# EAGLE design control-module (EAGLE 5.06)
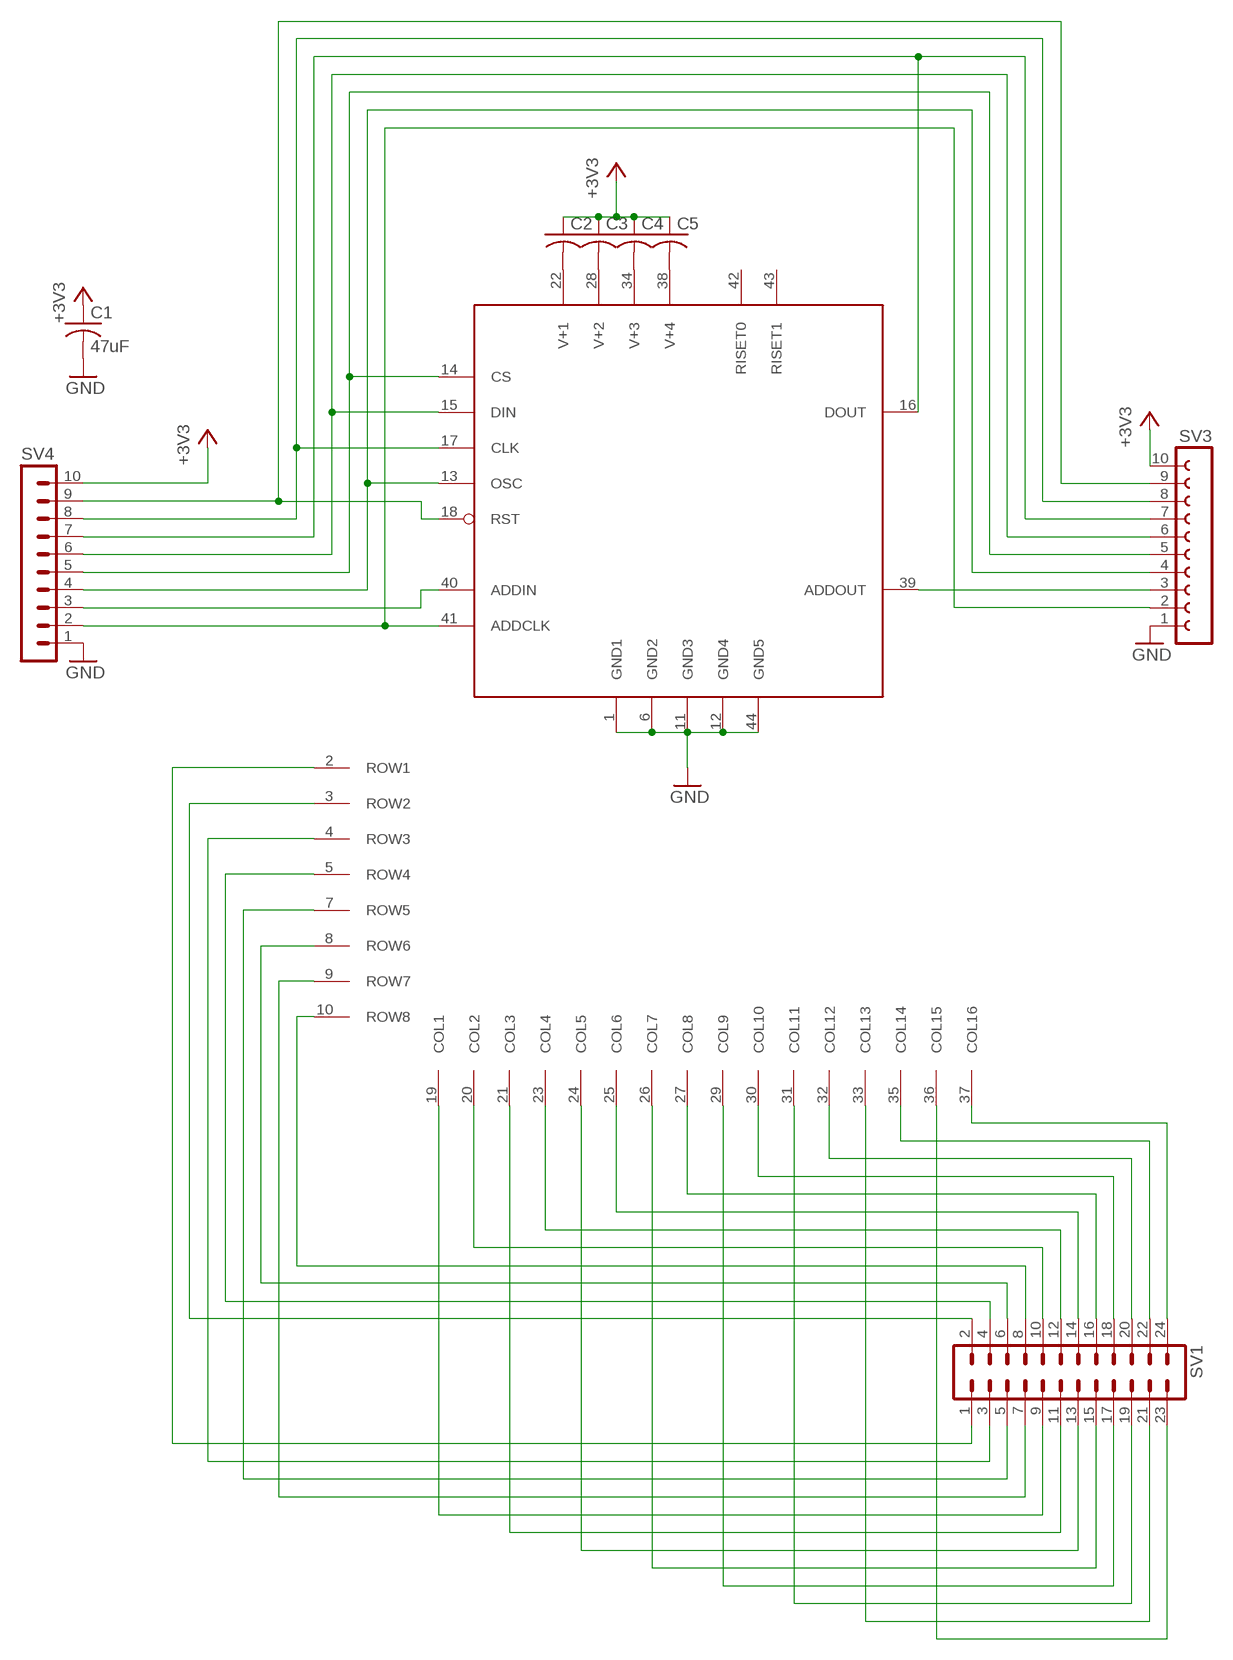
[diagram p0: schematic, sheet 1]

## Parts
C1  47uF  C-US025-024X044  [C025-024X044]
C2  C-USC2012  [C2012]
C3  C-USC2012  [C2012]
C4  C-USC2012  [C2012]
C5  C-USC2012  [C2012]
SV1  MA12-2  [MA12-2]
SV3  FE10-1  [FE10]
SV4  MA10-1  [MA10-1]
U$1  MAX6960_MQFP44  [MQFP44-2]

## Nets
+3V3: C1.1 C2.1 C3.1 C4.1 C5.1 SV3.10 SV4.10
GND: C1.2 SV3.1 SV4.1 U$1.1(GND1) U$1.6(GND2) U$1.11(GND3) U$1.12(GND4) U$1.44(GND5)
N$1: C2.2 U$1.22(V+1)
N$2: SV1.1 U$1.2(ROW1)
N$3: SV3.2 SV4.2 U$1.41(ADDCLK)
N$4: SV3.6 SV4.6 U$1.15(DIN)
N$5: SV3.9 SV4.9 U$1.18(RST)
N$6: SV3.3 U$1.39(ADDOUT)
N$7: SV1.2 U$1.3(ROW2)
N$8: SV1.3 U$1.4(ROW3)
N$9: SV3.8 SV4.8 U$1.17(CLK)
N$10: SV1.4 U$1.5(ROW4)
N$11: SV3.5 SV4.5 U$1.14(CS)
N$12: SV3.7 SV4.7 U$1.16(DOUT)
N$13: SV1.5 U$1.7(ROW5)
N$14: SV1.6 U$1.8(ROW6)
N$15: SV1.7 U$1.9(ROW7)
N$16: SV1.8 U$1.10(ROW8)
N$17: SV1.9 U$1.19(COL1)
N$18: SV1.11 U$1.21(COL3)
N$19: SV1.13 U$1.24(COL5)
N$20: SV1.15 U$1.26(COL7)
N$21: SV1.17 U$1.29(COL9)
N$22: SV1.19 U$1.31(COL11)
N$23: SV1.21 U$1.33(COL13)
N$24: SV1.23 U$1.36(COL15)
N$25: SV1.10 U$1.20(COL2)
N$26: SV1.12 U$1.23(COL4)
N$27: SV1.14 U$1.25(COL6)
N$28: SV1.16 U$1.27(COL8)
N$29: SV1.18 U$1.30(COL10)
N$30: SV1.20 U$1.32(COL12)
N$31: SV1.22 U$1.35(COL14)
N$32: SV1.24 U$1.37(COL16)
N$33: SV3.4 SV4.4 U$1.13(OSC)
N$34: C3.2 U$1.28(V+2)
N$35: SV4.3 U$1.40(ADDIN)
N$36: C4.2 U$1.34(V+3)
N$37: C5.2 U$1.38(V+4)
Unconnected: U$1.42(RISET0) U$1.43(RISET1)

## Library data of the parts
C1-C5 = resistor:C-US: CAPACITOR, American symbol
SV1 = con-lstb:MA12-2: PIN HEADER
SV3 = con-lsta:FE10-1: FEMALE HEADER
SV4 = con-lstb:MA10-1: PIN HEADER
U$1 = max6960:MAX6960_MQFP44

## Board
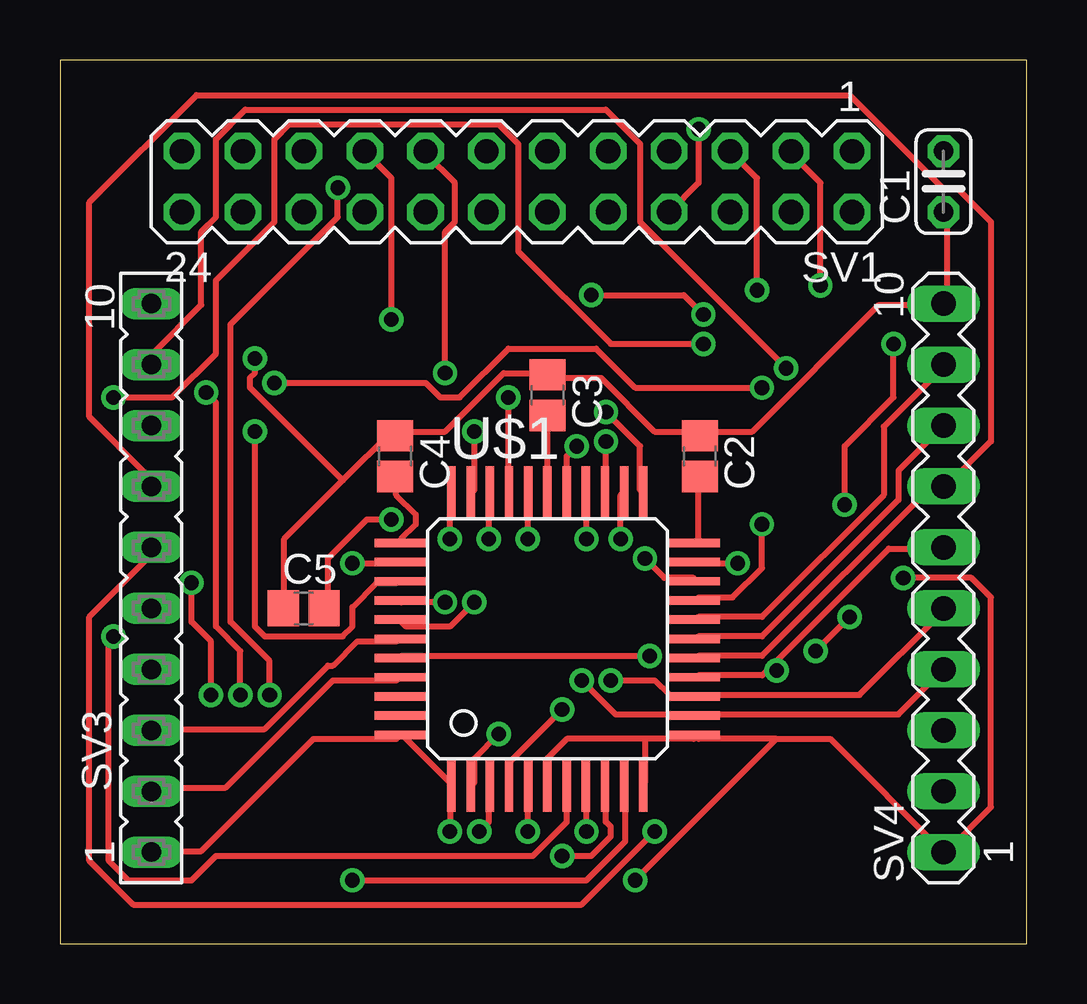
[diagram p1: board, top side]
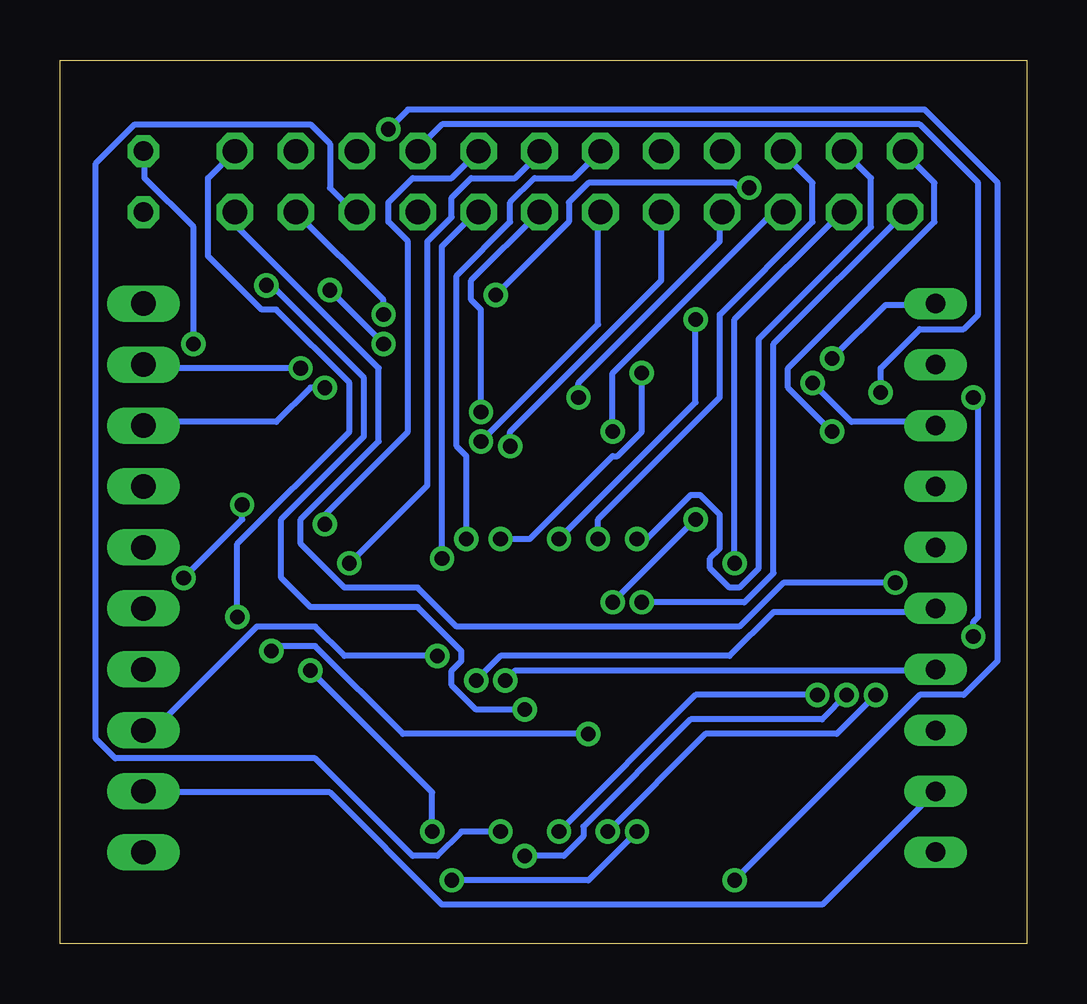
[diagram p2: board, bottom side, seen from below]

Size 40.31 x 36.82 mm. Coordinates in mm from the lower left corner, seen from the top.
Outline: 0,0 40.31,0 40.31,36.82 0,36.82 0,0
Copper layers (1*16): Top 0.035mm / dielectric 1.5mm / Bottom 0.035mm
Design rules "default": minimum track width 10mil, minimum drill 24mil, track to track 8mil, track to pad 8mil, pad to pad 8mil, via to via 8mil, smd to smd 8mil, copper to edge 40mil, drill to drill 8mil, minimum pad ring 10mil, minimum via ring 8mil, stop-mask expansion 4mil, vias tented up to drill 0mil, thermal gap 10mil

### Footprints (pad centres in the part's own frame; a part is rotated, then mirrored left to right if it is on the bottom)
C025-024X044 = drill 0.813 octagon: 1 -1.27,0; 2 1.27,0
C2012 = smd 1.3 x 1.5: 1 -0.85,0; 2 0.85,0
MA12-2 = drill 1.016 octagon: 1 -13.97,-1.27; 2 -13.97,1.27; 3 -11.43,-1.27; 4 -11.43,1.27; 5 -8.89,-1.27; 6 -8.89,1.27; 7 -6.35,-1.27; 8 -6.35,1.27; 9 -3.81,-1.27; 10 -3.81,1.27; 11 -1.27,-1.27; 12 -1.27,1.27; 13 1.27,-1.27; 14 1.27,1.27; 15 3.81,-1.27; 16 3.81,1.27; 17 6.35,-1.27; 18 6.35,1.27; 19 8.89,-1.27; 20 8.89,1.27; 21 11.43,-1.27; 22 11.43,1.27; 23 13.97,-1.27; 24 13.97,1.27
FE10 = drill 0.813 long: 1 -11.43,0; 2 -8.89,0; 3 -6.35,0; 4 -3.81,0; 5 -1.27,0; 6 1.27,0; 7 3.81,0; 8 6.35,0; 9 8.89,0; 10 11.43,0
MA10-1 = drill 1.016 long: 1 -11.43,0; 2 -8.89,0; 3 -6.35,0; 4 -3.81,0; 5 -1.27,0; 6 1.27,0; 7 3.81,0; 8 6.35,0; 9 8.89,0; 10 11.43,0
MQFP44-2 = smd 0.35 x 2.2: 1 -4,-6.1; 2 -3.2,-6.1; 3 -2.4,-6.1; 4 -1.6,-6.1; 5 -0.8,-6.1; 6 0,-6.1; 7 0.8,-6.1; 8 1.6,-6.1; 9 2.4,-6.1; 10 3.2,-6.1; 11 4,-6.1; 23 4,6.1; 24 3.2,6.1; 25 2.4,6.1; 26 1.6,6.1; 27 0.8,6.1; 28 0,6.1; 29 -0.8,6.1; 30 -1.6,6.1; 31 -2.4,6.1; 32 -3.2,6.1; 33 -4,6.1 | smd 2.2 x 0.35: 12 6.1,-4; 13 6.1,-3.2; 14 6.1,-2.4; 15 6.1,-1.6; 16 6.1,-0.8; 17 6.1,0; 18 6.1,0.8; 19 6.1,1.6; 20 6.1,2.4; 21 6.1,3.2; 22 6.1,4; 34 -6.1,4; 35 -6.1,3.2; 36 -6.1,2.4; 37 -6.1,1.6; 38 -6.1,0.8; 39 -6.1,0; 40 -6.1,-0.8; 41 -6.1,-1.6; 42 -6.1,-2.4; 43 -6.1,-3.2; 44 -6.1,-4

### Placement (x,y rotation side)
C1  36.83,31.75 90 top
C2  26.67,20.32 270 top
C3  20.32,22.86 270 top
C4  13.97,20.32 270 top
C5  10.16,13.97 0 top
SV1  19.05,31.75 180 top
SV3  3.81,15.24 90 top
SV4  36.83,15.24 90 top
U$1  20.32,12.7 0 top

### Tracks (layer width: path | path; a pad name or v marks a point on that pad's centre or on a via)
+3V3  (via drill 0.61)
  Top 0.254: 11.79,19.3 13.82,21.34 C4.1 14.02,21.34 16.05,21.34 18.49,23.77 20.32,23.77 C3.1 20.32,23.57 22.55,23.57 24.79,21.34 26.62,21.34 C2.1 26.82,21.34 28.85,21.34 34.14,26.62 36.78,26.62 SV4.10 36.98,26.82 36.98,30.48 C1.1 | 11.79,19.3 9.35,16.87 9.35,14.02 C5.1 | v8.13,24.38 8.13,23.77 7.92,23.57 7.92,23.16 11.79,19.3
  Bottom 0.254: v8.13,24.38 5.89,26.62 3.86,26.62 SV3.10
GND  (via drill 0.61)
  Top 0.254: SV3.1 3.86,3.86 5.89,3.86 10.57,8.53 14.02,8.53 U$1.44 14.22,8.74 16.26,6.71 U$1.1 16.26,6.5 v16.26,4.67 | 24.38,8.53 26.42,8.53 U$1.12 26.62,8.53 29.87,8.53 | 24.38,8.53 21.13,8.53 20.32,7.72 U$1.6 | 24.38,8.53 24.38,6.71 U$1.11 | v34.75,24.99 34.75,22.76 32.72,20.73 v32.72,18.29 | v35.15,15.24 38,15.24 38.81,14.43 38.81,5.69 36.98,3.86 SV4.1 32.11,8.53 29.87,8.53 | v23.98,2.64 29.87,8.53
  Bottom 0.254: v34.75,24.99 34.75,29.87 36.78,31.9 36.78,32.92 C1.2 | v32.72,18.29 32.72,17.68 v35.15,15.24 | v16.26,4.67 18.29,2.64 v23.98,2.64
N$1
  Top 0.254: C2.2 26.62,19.3 26.62,16.87 U$1.22
N$2  (via drill 0.61)
  Top 0.254: v18.29,8.74 17.27,7.72 17.27,6.71 U$1.2 | v31.5,12.19 v32.92,13.61
  Bottom 0.254: v18.29,8.74 26.01,8.74 29.67,12.39 31.29,12.39 v31.5,12.19 | v32.92,13.61 32.92,16.66 28.25,21.34 28.25,23.37 31.29,26.42 31.9,26.42 34.14,28.65 34.14,31.9 SV1.1
N$3
  Top 0.254: U$1.41 14.02,10.97 11.38,10.97 6.91,6.5 3.86,6.5 SV3.2
  Bottom 0.254: SV4.2 36.78,6.3 29.06,6.3 24.38,1.63 8.53,1.63 SV3.2
N$4  (via drill 0.61)
  Top 0.254: 29.67,11.58 34.54,16.46 36.78,16.46 SV4.6 | 29.67,11.58 29.26,11.18 26.62,11.18 U$1.15 | v24.79,4.67 21.74,1.63 3.05,1.63 1.22,3.45 1.22,13.61 3.66,16.05 3.66,16.46 SV3.6 | v29.87,11.38 29.67,11.58
  Bottom 0.254: v24.79,4.67 24.79,6.3 v29.87,11.38
N$5  (via drill 0.61)
  Top 0.254: U$1.18 26.62,13.61 29.26,13.61 34.34,18.69 34.34,21.54 36.78,23.98 SV4.9 | v30.28,23.98 24.18,30.07 24.18,33.33 22.76,34.75 7.72,34.75 6.5,33.53 6.5,30.28 5.89,29.67 5.89,26.62 3.86,24.59 3.86,24.18 SV3.9
  Bottom 0.254: v30.28,23.98 36.78,23.98 SV4.9
N$6
  Top 0.254: U$1.39 14.02,12.6 12.39,12.6 11.38,11.58 11.18,11.58 8.53,8.94 3.86,8.94 SV3.3
N$7  (via drill 0.61)
  Top 0.254: v17.48,4.67 17.88,5.08 17.88,6.5 U$1.3 | v6.3,10.36 6.3,12.6 5.49,13.41 v5.49,15.04
  Bottom 0.254: v17.48,4.67 13.41,8.74 7.92,8.74 v6.3,10.36 | v5.49,15.04 10.16,15.04 11.99,13.21 23.77,13.21 25.4,14.83 28.45,14.83 30.28,16.66 30.28,17.68 27.03,20.93 27.03,23.98 32.92,29.87 32.92,30.48 SV1.2
N$8  (via drill 0.61)
  Top 0.254: v20.93,9.75 18.69,7.52 18.69,6.71 U$1.4 | v31.7,27.43 31.7,31.7 30.48,32.92 SV1.3
  Bottom 0.254: v20.93,9.75 22.96,9.75 23.98,10.77 23.98,11.38 23.57,11.79 23.57,12.19 25.4,14.02 29.87,14.02 31.09,15.24 31.09,17.68 27.64,21.13 27.64,23.57 31.5,27.43 v31.7,27.43
N$9  (via drill 0.61)
  Top 0.254: U$1.17 26.62,12.8 29.26,12.8 34.95,18.49 34.95,19.71 SV4.8 | v8.94,23.37 15.24,23.37 15.85,22.76 16.66,22.76 18.69,24.79 22.35,24.79 23.98,23.16 v29.26,23.16
  Bottom 0.254: v8.94,23.37 7.32,21.74 3.86,21.74 SV3.8 | v29.26,23.16 29.87,23.16 31.29,21.74 36.78,21.74 SV4.8
N$10  (via drill 0.61)
  Top 0.254: v19.51,4.67 19.51,6.5 U$1.5 | v8.74,10.36 8.74,11.79 7.11,13.41 7.11,25.81 11.58,30.28 v11.58,31.5 | v22.15,27.03 26.01,27.03 v26.82,26.21
  Bottom 0.254: v19.51,4.67 13.82,10.36 v8.74,10.36 | v11.58,31.5 11.99,31.5 12.19,31.7 18.29,31.7 19.1,30.89 19.1,30.07 v22.15,27.03 | v26.82,26.21 26.82,26.82 SV1.4
N$11  (via drill 0.61)
  Top 0.254: SV4.5 36.78,13.82 33.33,10.36 26.62,10.36 U$1.14 26.42,10.36 25.4,10.36 24.79,10.97 v22.96,10.97
  Bottom 0.254: v22.96,10.97 21.95,11.99 12.39,11.99 10.57,13.82 3.86,13.82 SV3.5
N$12
  Top 0.254: U$1.16 26.62,11.99 29.26,11.99 36.17,18.9 36.78,18.9 SV4.7 36.98,19.1 38.81,20.93 38.81,30.07 37.39,31.5 36.78,31.5 32.92,35.36 5.69,35.36 1.22,30.89 1.22,21.95 3.66,19.51 3.66,19.1 SV3.7
N$13  (via drill 0.61)
  Top 0.254: v2.23,12.8 2.03,12.6 2.03,3.45 2.85,2.64 5.49,2.64 6.5,3.66 19.71,3.66 21.13,5.08 21.13,6.5 U$1.7 | v2.23,22.76 4.67,22.76 6.5,24.59 6.5,27.64 8.94,30.07 8.94,33.53 9.55,34.14 18.29,34.14 19.1,33.33 19.1,28.85 22.96,24.99 v26.82,24.99 | v29.06,27.23 29.06,31.9 SV1.5
  Bottom 0.254: v2.23,12.8 2.23,13.41 2.03,13.61 2.03,22.55 v2.23,22.76 | v26.82,24.99 v29.06,27.23
N$14  (via drill 0.61)
  Top 0.254: v21.95,4.67 21.95,6.5 U$1.8
  Bottom 0.254: v21.95,4.67 23.57,4.67 24.59,3.66 25.6,3.66 29.67,7.72 38,7.72 38.81,8.53 38.81,32.51 37.19,34.14 29.87,34.14 29.06,33.33 29.06,31.5 28.04,30.48 SV1.6
N$15  (via drill 0.61)
  Top 0.254: v20.93,3.66 22.15,3.66 22.96,4.47 22.96,4.88 22.76,5.08 22.76,6.5 U$1.9 | v7.52,10.36 7.52,12.19 6.5,13.21 6.5,22.55 v6.1,22.96
  Bottom 0.254: v20.93,3.66 19.3,3.66 18.49,4.47 18.49,4.88 14.02,9.35 8.53,9.35 v7.52,10.36 | v6.1,22.96 6.1,23.98 4.47,25.6 2.64,25.6 2.03,26.21 2.03,31.7 4.47,34.14 24.38,34.14 25.4,33.12 SV1.7
N$16  (via drill 0.61)
  Top 0.254: v12.19,2.64 21.95,2.64 23.57,4.27 23.57,6.5 U$1.10 | v26.62,33.93 26.62,31.7 SV1.8
  Bottom 0.254: v12.19,2.64 4.47,10.36 2.64,10.36 1.22,11.79 1.22,31.7 4.27,34.75 25.81,34.75 v26.62,33.93
N$17  (via drill 0.61)
  Top 0.254: v29.26,17.48 29.26,15.65 28.04,14.43 26.62,14.43 U$1.19
  Bottom 0.254: v29.26,17.48 29.26,17.88 25.81,21.34 25.81,29.26 26.62,30.07 26.62,30.89 25.6,31.9 23.98,31.9 SV1.9
N$18  (via drill 0.61)
  Top 0.254: v28.25,15.85 26.62,15.85 U$1.21
  Bottom 0.254: v28.25,15.85 24.99,19.1 24.99,29.26 23.98,30.28 23.98,31.09 23.16,31.9 21.34,31.9 20.32,32.92 SV1.11
N$19  (via drill 0.61)
  Top 0.254: v23.37,16.87 23.37,18.69 U$1.24
  Bottom 0.254: v23.37,16.87 23.37,20.32 23.77,20.73 23.77,27.84 21.54,30.07 21.54,30.89 20.52,31.9 18.9,31.9 SV1.13
N$20  (via drill 0.61)
  Top 0.254: v21.95,16.87 21.95,18.69 U$1.26 | v16.05,23.77 16.05,29.67 16.46,30.07 16.46,31.7 15.24,32.92 SV1.15
  Bottom 0.254: v21.95,16.87 20.73,16.87 17.27,20.32 17.07,20.32 16.05,21.34 v16.05,23.77
N$21  (via drill 0.61)
  Top 0.254: v19.51,16.87 19.51,18.69 U$1.29 | v13.82,26.01 13.82,31.9 SV1.17
  Bottom 0.254: v19.51,16.87 13.82,22.55 v13.82,26.01
N$22  (via drill 0.61)
  Top 0.254: v17.88,16.87 17.88,18.69 U$1.31
  Bottom 0.254: v17.88,16.87 17.88,17.68 12.8,22.76 12.8,26.21 8.94,30.07 8.94,31.7 10.16,32.92 SV1.19
N$23  (via drill 0.61)
  Top 0.254: v16.26,16.87 16.26,18.69 U$1.33
  Bottom 0.254: v16.26,16.87 15.85,16.87 14.02,18.69 13.61,18.69 12.8,17.88 12.8,16.46 13.21,16.05 13.21,15.65 12.39,14.83 11.99,14.83 11.18,15.65 11.18,25.2 6.5,29.87 6.5,31.9 SV1.21
N$24  (via drill 0.61)
  Top 0.254: v8.13,21.34 8.13,13.21 8.53,12.8 11.79,12.8 12.19,13.21 12.19,14.02 13.21,15.04 14.02,15.04 U$1.36
  Bottom 0.254: v8.13,21.34 9.96,23.16 9.96,23.98 3.86,30.07 3.86,31.7 5.08,32.92 SV1.23
N$25  (via drill 0.61)
  Top 0.254: v24.38,16.05 25.2,15.24 26.42,15.24 U$1.20
  Bottom 0.254: v24.38,16.05 24.38,29.06 22.96,30.48 SV1.10
N$26  (via drill 0.61)
  Top 0.254: v22.76,22.15 24.18,20.73 24.18,18.9 U$1.23
  Bottom 0.254: v22.76,22.15 22.76,26.42 23.16,26.82 23.16,27.64 SV1.12
N$27  (via drill 0.61)
  Top 0.254: v22.76,20.93 22.76,18.9 U$1.25
  Bottom 0.254: v22.76,20.93 17.88,25.81 17.88,30.48 SV1.14
N$28  (via drill 0.61)
  Top 0.254: v21.54,20.73 21.13,20.32 21.13,18.9 U$1.27
  Bottom 0.254: v21.54,20.73 21.54,21.34 15.24,27.64 SV1.16
N$29  (via drill 0.61)
  Top 0.254: v18.69,22.76 18.69,18.9 U$1.30
  Bottom 0.254: v18.69,22.76 18.69,23.37 12.8,29.26 12.8,30.48 SV1.18
N$30  (via drill 0.61)
  Top 0.254: v17.27,21.34 17.27,18.9 U$1.32
  Bottom 0.254: v17.27,21.34 17.27,23.77 10.57,30.48 SV1.20
N$31  (via drill 0.61)
  Top 0.254: v12.19,15.85 14.02,15.85 U$1.35
  Bottom 0.254: v12.19,15.85 12.19,26.01 7.72,30.48 SV1.22
N$32  (via drill 0.61)
  Top 0.254: v16.05,14.22 14.22,14.22 U$1.37
  Bottom 0.254: v16.05,14.22 11.79,14.22 10.57,15.44 10.57,24.99 SV1.24
N$33  (via drill 0.61)
  Top 0.254: SV4.4 34.95,9.55 26.62,9.55 U$1.13 26.42,9.55 23.16,9.55 v21.74,10.97
  Bottom 0.254: v21.74,10.97 21.34,11.38 3.86,11.38 SV3.4
N$34
  Top 0.254: U$1.28 C3.2
N$35  (via drill 0.61)
  Top 0.254: v24.59,11.99 14.22,11.99 U$1.40
  Bottom 0.254: v24.59,11.99 28.45,11.99 29.67,13.21 32.11,13.21 36.37,8.94 36.78,8.94 SV4.3
N$36
  Top 0.254: C4.2 14.02,19.3 14.02,18.69 14.83,17.88 14.83,17.48 14.22,16.87 U$1.34
N$37  (via drill 0.61)
  Top 0.254: v13.82,17.68 12.8,17.68 11.18,16.05 11.18,14.02 C5.2 | v17.27,14.22 16.26,13.21 14.43,13.21 14.22,13.41 U$1.38
  Bottom 0.254: v13.82,17.68 v17.27,14.22